# Altium project Hydros Electrical Schematic.PrjPcb
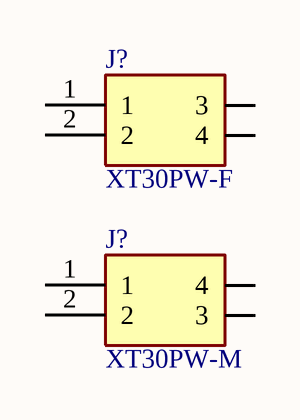
[diagram p0: Master.SchDoc]
5 sheets, 2 parts. Net scope: global (net labels, ports and power ports of the same name join across sheets).
Sheets:
  Master.SchDoc
  Telemetry.SchDoc
  SteeringWheel.SchDoc
  FCCU.SchDoc
  PowerCircut.SchDoc

## Sheet Master.SchDoc
size A4; SheetNumber: 1; SheetTotal: 5

### Parts
(Parts that share a designator on the sheet are numbered #1, #2 ... from top to bottom, then left to right.)
J?#1  XT30PW-F  [XT30PWF]
J?#2  XT30PW-M  [XT30PWM]

### Nets

Not connected (* = marked no-connect by the designer): J?#1 1 2 3 4; J?#2 1 2 3 4

### Library data of the parts
J?#1 = XT30PW-F: Socket; DC supply; XT30; female; PIN:2; on PCBs; THT; Colour: yellow; Manufacturer_Name: Amass; Geometry.Height: 5mm; Manufacturer_Part_Number: XT30PW-F; Mouser Part Number: *; Mouser Price/Stock: *; Arrow Part Number: *; Arrow Price/Stock: *; Datasheet Link: https://www.tme.eu/Document/ce4077e36b79046da520ca73227e15de/XT30PW%20SPEC.pdf
J?#2 = XT30PW-M: 30A Low Temperature Rise Fire Retardant Plug; Manufacturer_Name: Amass; Geometry.Height: 5mm; Manufacturer_Part_Number: XT30PW-M; Mouser Part Number: *; Mouser Price/Stock: *; Arrow Part Number: *; Arrow Price/Stock: *; Datasheet Link: https://www.tme.eu/sl/Document/ce4077e36b79046da520ca73227e15de/XT30PW%20SPEC.pdf; ComponentLink1URL: https://datasheet.octopart.com/XT30PW-M-Amass-datasheet-165556440.pdf?src-supplier=TME; ComponentLink1Description: https://datasheet.octopart.com/XT30PW-M-Amass-datasheet-165556440.pdf?src-supplier=TME

## Sheet Telemetry.SchDoc
size A4; SheetNumber: 2; SheetTotal: 2

## Sheet SteeringWheel.SchDoc
size A4; SheetNumber: 3; SheetTotal: 3

## Sheet FCCU.SchDoc
size A4; SheetNumber: 4; SheetTotal: 4

## Sheet PowerCircut.SchDoc
size A4; SheetNumber: 5; SheetTotal: 5